# EAGLE design Netzteil_V_1.0 (EAGLE 9.4.0)
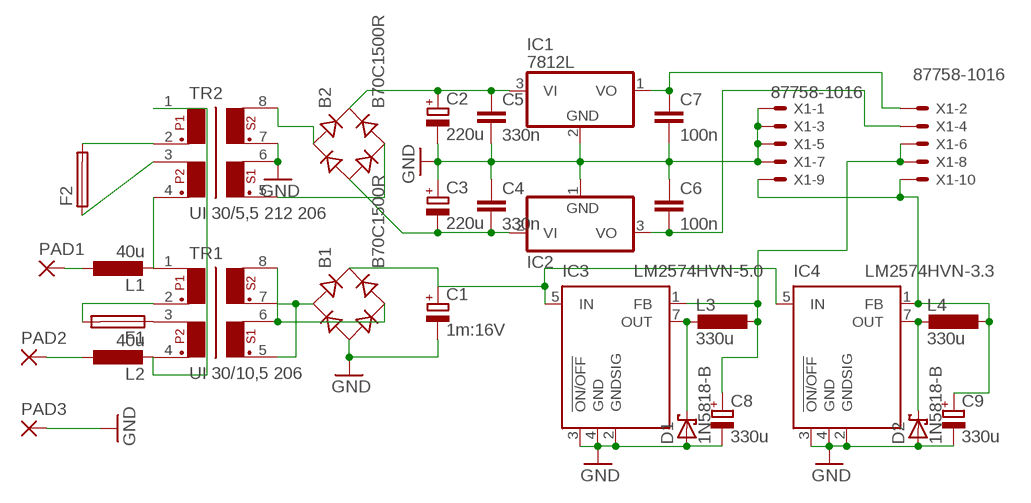
[diagram p0: schematic, sheet 1]

## Parts
B1  B70C1500R  RB1A  [RB1A]
B2  B70C1500R  RB1A  [RB1A]
C1  1m:16V  CPOL-EUE5-13  [E5-13]
C2  220u  CPOL-EUE5-10.5  [E5-10,5]
C3  220u  CPOL-EUE5-10.5  [E5-10,5]
C4  330n  C-EU102-064X133  [C102-064X133]
C5  330n  C-EU102-064X133  [C102-064X133]
C6  100n  C-EU102-064X133  [C102-064X133]
C7  100n  C-EU102-054X133  [C102-054X133]
C8  330u  CPOL-EUE2.5-7  [E2,5-7]
C9  330u  CPOL-EUE2.5-7  [E2,5-7]
D1  1N5818-B  [DO41-7.6]
D2  1N5818-B  [DO41-7.6]
F1  SH25  [SH25]
F2  SH25  [SH25]
IC1  7812L  [TO92]
IC2  7912L  [TO92]
IC3  LM2574HVN-5.0  [DIL08]
IC4  LM2574HVN-3.3  [DIL08]
L1  40u  L-EUIRF-24  [IRF24]
L2  40u  L-EUIRF-24  [IRF24]
L3  330u  L-EU0207/5V  [0207/5V]
L4  330u  L-EU0207/5V  [0207/5V]
PAD1  3,81/1,4  [3,81/1,4]
PAD2  3,81/1,4  [3,81/1,4]
PAD3  3,81/1,4  [3,81/1,4]
TR1  UI 30/10,5 206  FL02  [FL02-08]
TR2  UI 30/5,5 212 206  FL02  [FL02-08]
X1  87758-1016  [87758-1016]

## Nets
3V3: C9.+ IC4.1(FB) L4.1 X1.9 X1.10
5V: C8.+ IC3.1(FB) L3.1 X1.6 X1.8
+12V: C7.1 IC1.1(VO) X1.2
-12V: C6.2 IC2.3(VO) X1.4
GND: B1.- C1.- C2.- C3.+ C4.1 C5.2 C6.1 C7.2 C8.- C9.- D1.A D2.A IC1.2(GND) IC2.1(GND) IC3.2(GNDSIG) IC3.3(!ON/OFF) IC3.4(GND) IC4.2(GNDSIG) IC4.3(!ON/OFF) IC4.4(GND) PAD3.1(P) TR2.6 TR2.7 X1.1 X1.3 X1.5 X1.7
N$1: F1.1 TR1.3
N$2: F1.2 TR1.2
N$3: B1.AC1 TR1.5 TR1.7
N$4: B1.AC2 TR1.6 TR1.8
N$5: B1.+ C1.+ IC3.5(IN) IC4.5(IN)
N$6: B2.- C3.- C4.2 IC2.2(VI)
N$7: L1.2 TR1.1 TR2.4
N$8: L2.2 TR1.4 TR2.1
N$9: D1.C IC3.7(OUT) L3.2
N$10: B2.AC1 TR2.8
N$11: B2.AC2 TR2.5
N$12: B2.+ C2.+ C5.1 IC1.3(VI)
N$13: F2.1 TR2.3
N$14: F2.2 TR2.2
N$16: D2.C IC4.7(OUT) L4.2
N$18: L1.1 PAD1.1(P)
N$20: L2.1 PAD2.1(P)

## Library data of the parts
B1 B2 = rectifier:RB1A: RECTIFIER 1 A
C1-C3 C8 C9 = rcl:CPOL-EU: POLARIZED CAPACITOR, European symbol; SPICEPREFIX: C
C4-C7 = rcl:C-EU: CAPACITOR, European symbol; SPICEPREFIX: C
D1 D2 = diode:1N581*: 1.0A SCHOTTKY BARRIER RECTIFIER Source: http://www.diodes.com/datasheets/ds23001.pdf
F1 F2 = fuse:SH25: FUSE HOLDER grid 25 mm, OGN0031 8211, Schurter (Buerklin); MF: SCHURTER; MPN: 0031.8211; OC_FARNELL: 1162741; OC_NEWARK: 96B9380
IC1 = linear:78*: Positive VOLTAGE REGULATOR Source: http://cache.national.com/ds/LM/LM78L05.pdf http://www.fairchildsemi.com/ds/LM/LM7805.pdf
IC2 = linear:79*: Negative VOLTAGE REGULATOR
IC3 IC4 = linear:LM2574?-*: SIMPLE SWITCHER 0.5A Step-Down Voltage Regulator Source: http://cache.national.com/ds/LM/LM2574.pdf
L1-L4 = rcl:L-EU: INDUCTOR, European symbol; SPICEPREFIX: L
PAD1-PAD3 = wirepad:3,81/1,4: THROUGH-HOLE PAD
TR1 TR2 = trafo:FL02: TRANSFORMER 2 primary winding, 2 secondary windings, mounting holes BLOCK
X1 = con-molex:87758-1016: 10 Pin - 2mm Dual Row Single Wafer, Vertical T/H HDR Source: http://www.molex.com/pdm_docs/sd/877580616_sd.pdf; MF: MOLEX; MPN: 87758-1016; OC_FARNELL: 7472340; OC_NEWARK: 59J1558

## Board
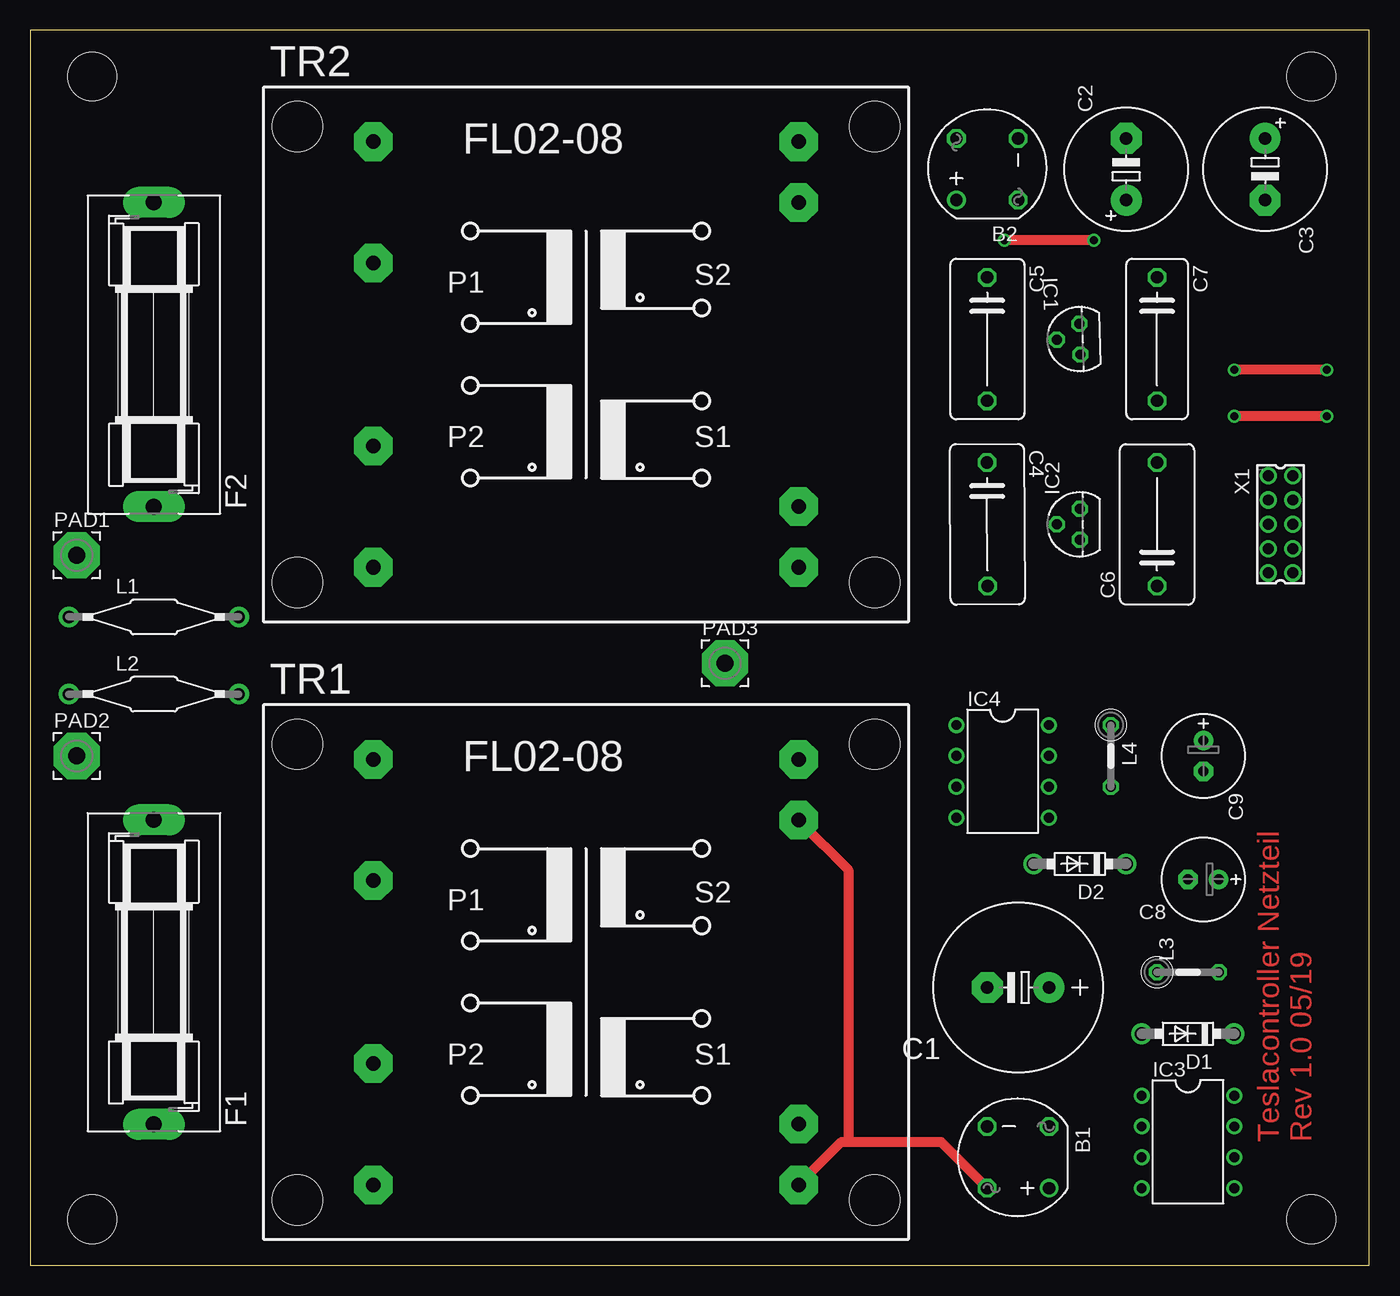
[diagram p1: board, top side]
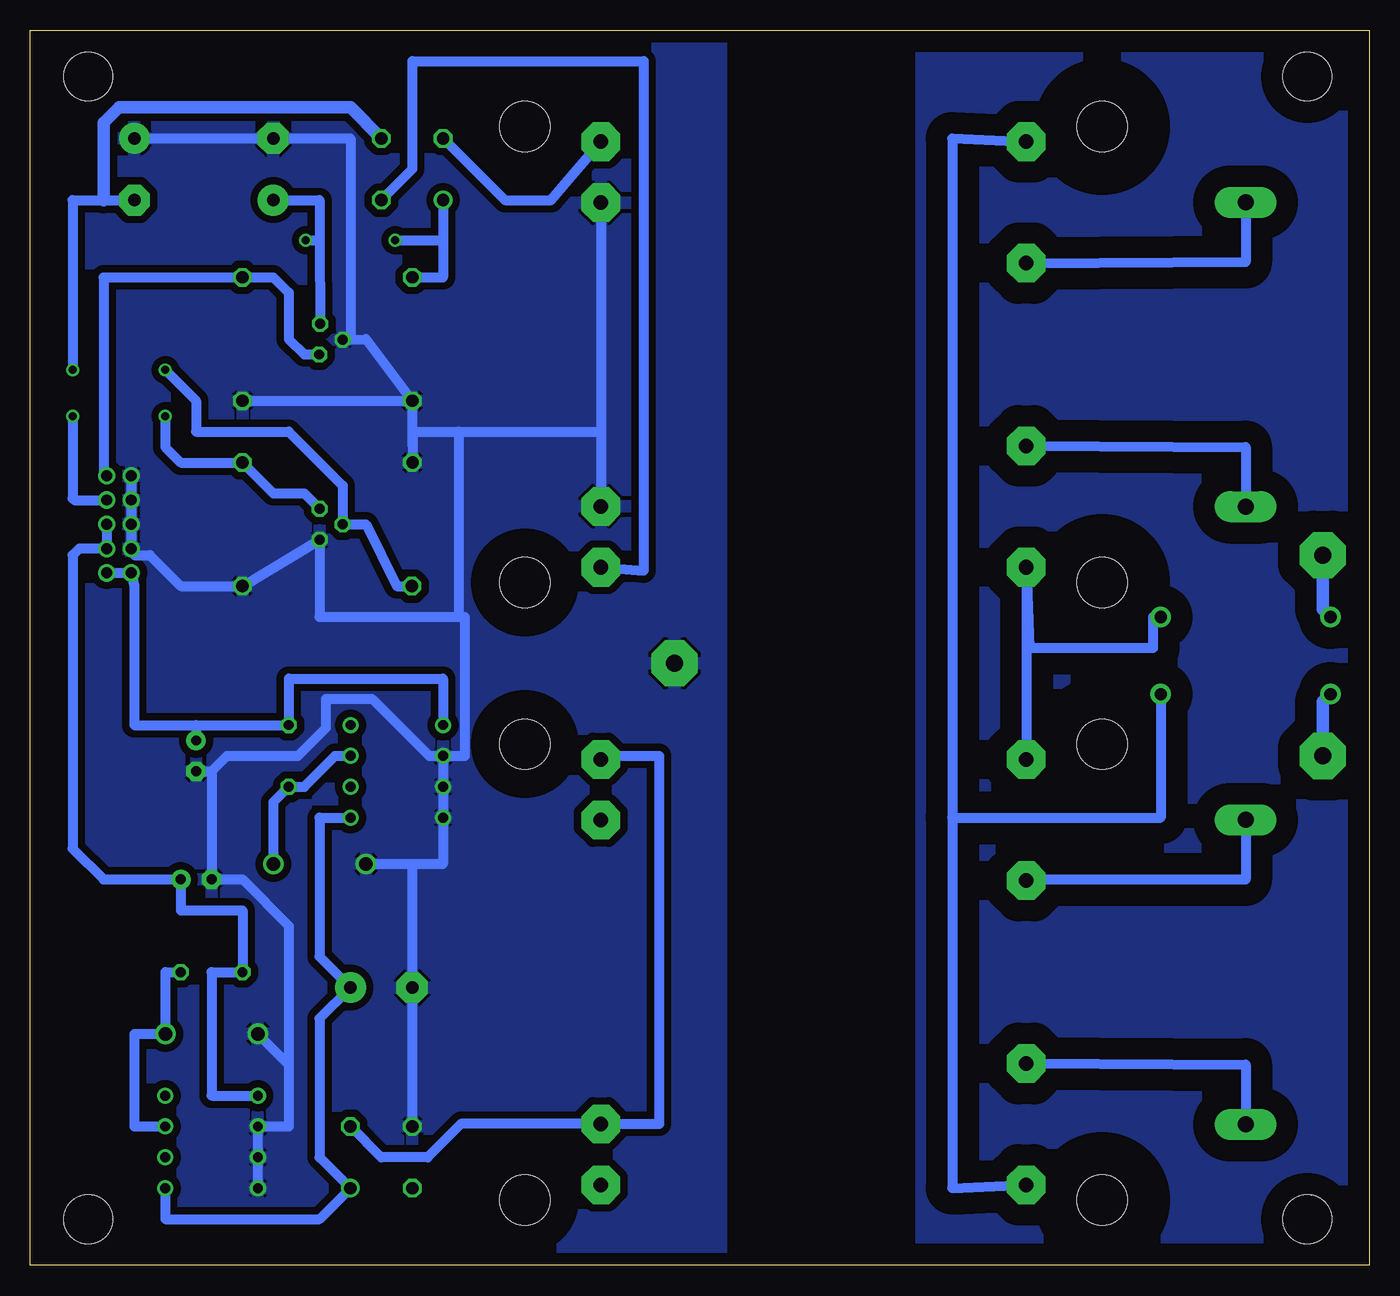
[diagram p2: board, bottom side, seen from below]

Size 110.16 x 101.59 mm. Coordinates in mm from the lower left corner, seen from the top.
Outline: 0,0 110.16,0 110.16,101.59 0,101.59 0,0
Copper layers (1*16): Top 0.035mm / dielectric 1.5mm / Bottom 0.035mm
Design rules "default": minimum track width 6mil, minimum drill 0.35mm, track to track 6mil, track to pad 6mil, pad to pad 6mil, via to via 6mil, smd to smd 6mil, copper to edge 40mil, drill to drill 6mil, minimum pad ring 10mil, minimum via ring 8mil, stop-mask expansion 4mil, vias tented up to drill 0mil, thermal gap 10mil
Holes 4 mm at 5.08,97.79 105.41,97.79 5.08,3.81 105.41,3.81

### Footprints (pad centres in the part's own frame; a part is rotated, then mirrored left to right if it is on the bottom)
RB1A = drill 1.016: + -2.54,2.54 | drill 1.016 octagon: - 2.54,-2.54; AC1 2.54,2.54; AC2 -2.54,-2.54
E5-13 = drill 1.016 pad 2.54: + -2.54,0 | drill 1.016 pad 2.54 octagon: - 2.54,0
E5-10,5 = drill 1.016 pad 2.54: + -2.54,0 | drill 1.016 pad 2.54 octagon: - 2.54,0
C102-064X133 = drill 1.016 octagon: 1 -5.08,0; 2 5.08,0
C102-054X133 = drill 1.016 octagon: 1 -5.08,0; 2 5.08,0
E2,5-7 = drill 0.813 pad 1.6: + -1.27,0 | drill 0.813 pad 1.6 octagon: - 1.27,0
DO41-7.6 = drill 1.1 pad 1.7: A 3.81,0; C -3.81,0
SH25 = drill 1.321 pad 2.54 long: 1 -12.522,0; 2 12.522,0
TO92 = drill 0.813 octagon: 1 -1.27,0; 2 0,1.905; 3 1.27,0
DIL08 = drill 0.813 pad 1.27: 1 -3.81,-3.81; 2 -1.27,-3.81; 3 1.27,-3.81; 4 3.81,-3.81; 5 3.81,3.81; 6 1.27,3.81; 7 -1.27,3.81; 8 -3.81,3.81
IRF24 = drill 1 pad 1.676: 1 -6.985,0; 2 6.985,0
0207/5V = drill 0.813 octagon: 1 -2.54,0; 2 2.54,0
3,81/1,4 = drill 1.397 pad 3.81 octagon: 1 0,0
FL02-08 = drill 1.194 pad 3.175 octagon: 1 -17.501,17.501; 2 -17.501,7.518; 3 -17.501,-7.518; 4 -17.501,-17.501; 5 17.501,-17.501; 6 17.501,-12.497; 7 17.501,12.497; 8 17.501,17.501 | hole 4.115: 23.749,18.745; 23.749,-18.745; -23.749,-18.745; -23.749,18.745
87758-1016 = drill 0.9 pad 1.27: 1 -4,-1; 2 -4,1; 3 -2,-1; 4 -2,1; 5 0,-1; 6 0,1; 7 2,-1; 8 2,1; 9 4,-1; 10 4,1

### Placement (x,y rotation side)
B1  81.28,8.89 180 top
B2  78.74,90.17 90 top
C1  81.28,22.86 180 top
C2  90.17,90.17 90 top
C3  101.6,90.17 270 top
C4  78.74,60.96 270.3 top
C5  78.74,76.2 270 top
C6  92.71,60.96 90 top
C7  92.71,76.2 270 top
C8  96.52,31.75 180 top
C9  96.52,41.91 270 top
D1  95.25,19.05 180 top
D2  86.36,33.02 180 top
F1  10.16,24.13 90 top
F2  10.16,74.93 90 top
IC1  86.36,76.2 91.8 top
IC2  86.36,60.96 90 top
IC3  95.25,10.16 270 top
IC4  80.01,40.64 270 top
L1  10.16,53.34 0 top
L2  10.16,46.99 0 top
L3  95.25,24.13 0 top
L4  88.9,41.91 270 top
PAD1  3.81,58.42 0 top
PAD2  3.81,41.91 0 top
PAD3  57.15,49.53 0 top
TR1  45.72,24.13 0 top
TR2  45.72,74.93 0 top
X1  102.87,60.96 270 top

### Tracks (layer width: path | path; a pad name or v marks a point on that pad's centre or on a via)
3V3
  Bottom 0.813: IC4.1 76.2,48.26 88.9,48.26 L4.1 96.52,44.45 | 96.52,44.45 C9.+ | X1.10 X1.9 101.6,55.88 101.6,44.45 96.52,44.45
5V
  Bottom 0.813: IC3.1 95.25,13.97 95.25,24.13 L3.1 92.71,29.21 97.79,29.21 C8.+ 104.14,31.75 106.68,34.29 106.68,58.42 106.14,58.96 X1.8 X1.6
+12V
  Bottom 0.813: IC1.1 87.63,74.93 88.9,76.2 88.9,80.01 90.17,81.28 C7.1 104.14,81.28 104.14,64.77 X1.2
-12V  (via drill 0.65)
  Top 0.813: v106.68,69.85 v99.06,69.85
  Bottom 0.813: IC2.3 87.63,63.5 90.17,63.5 C6.2 97.79,66.04 99.06,67.31 v99.06,69.85 | X1.4 106.54,62.96 106.68,63.1 v106.68,69.85
EA
  pour Bottom (isolate 1.778): 0,101.6 36.83,101.6 36.83,0 0,0
GND
  Bottom 0.813: TR2.7 63.22,68.58 | 63.22,68.58 TR2.6 | C5.2 C4.1 78.74,68.58 | 78.74,68.58 74.93,68.58 | 74.93,68.58 63.22,68.58 | C3.+ C2.- 83.82,92.71 83.82,76.16 | 83.82,76.16 82.55,76.2 | 83.82,76.16 IC1.2 82.55,76.2 | B1.- C1.- 78.74,33.02 D2.A 76.2,33.02 IC4.4 IC4.3 IC4.2 | IC3.4 IC3.3 IC3.2 88.9,11.43 88.9,16.51 | D1.A 88.9,16.51 | 82.55,76.2 C5.2 | C5.2 78.74,68.58 | IC4.2 74.42,41.91 74.42,53.34 74.93,53.34 | 74.93,68.58 74.93,53.34 | 74.93,53.34 86.36,53.34 IC2.1 C6.1 97.79,55.88 100.33,58.42 101.6,58.42 X1.7 X1.5 X1.3 X1.1 | C9.- 95.25,40.64 | 95.25,40.64 C8.- 92.71,31.75 88.9,27.94 88.9,16.51 | 95.25,40.64 93.98,41.91 88.14,41.91 85.85,44.2 85.85,46.61 82.04,46.61 77.34,41.91 IC4.2 | C7.2 C5.2
  pour Bottom (isolate 0.61): 53.34,101.6 110.49,101.6 110.49,0 53.34,0
N$1
  Bottom 0.813: F1.1 10.16,16.51 TR1.3
N$2
  Bottom 0.813: F1.2 10.16,31.75 29.21,31.75 TR1.2
N$3
  Top 0.813: TR1.5 66.75,10.16 67.31,10.16 | 67.31,10.16 74.93,10.16 B1.AC1 | TR1.7 67.31,32.54 67.31,10.16
  Bottom 0.813: 63.5,6.35 TR1.5
N$4
  Bottom 0.813: TR1.8 63.5,41.91 58.42,41.91 58.42,11.63 TR1.6 | 63.5,11.43 TR1.6 | B1.AC2 81.28,8.89 77.47,8.89 74.73,11.63 TR1.6
N$5
  Bottom 0.813: IC4.5 86.36,36.83 86.36,25.4 C1.+ 86.36,20.32 86.36,8.89 B1.+ 86.36,3.81 99.06,3.81 IC3.5
N$6  (via drill 0.65)
  Top 0.813: v106.68,73.66 v99.06,73.66
  Bottom 0.813: C4.2 80.01,55.88 82.55,60.96 IC2.2 84.45,64.14 88.9,68.58 96.52,68.58 96.52,71.12 v99.06,73.66 | v106.68,73.66 106.68,87.63 104.14,87.63 C3.-
  Bottom 1.016: 104.14,87.63 104.14,93.98 102.87,95.25 83.82,95.25 B2.-
N$7
  Bottom 0.813: TR1.1 TR2.4 27.94,50.8 17.78,50.8 17.78,53.34 L1.2
N$8
  Bottom 0.813: TR2.1 34.29,92.71 34.29,36.83 | 34.29,36.83 34.29,6.35 TR1.4 | L2.2 17.14,36.83 34.29,36.83
N$9
  Bottom 0.813: L3.2 99.06,24.13 D1.C 101.6,19.05 101.6,11.43 IC3.7
N$10
  Bottom 0.813: TR2.8 67.31,87.63 71.12,87.63 B2.AC1
N$11
  Bottom 0.813: TR2.5 59.69,57.15 59.69,99.06 78.74,99.06 78.74,90.17 B2.AC2
N$12  (via drill 0.65)
  Top 0.813: v87.5,84.33 v80.14,84.33
  Bottom 0.813: B2.+ 76.2,84.33 | 76.2,84.33 76.2,81.28 C5.1 | C2.+ 86.36,87.63 86.35,84.33 | 86.35,84.33 IC1.3 | v87.5,84.33 86.35,84.33 | 86.35,84.33 | v80.14,84.33 76.2,84.33
N$13
  Bottom 0.813: TR2.3 10.16,67.31 F2.1
N$14
  Bottom 0.813: F2.2 10.16,82.55 TR2.2
N$16
  Bottom 0.813: D2.C 90.17,38.1 L4.2 87.63,39.37 85.09,41.91 IC4.7
N$18
  Bottom 1.016: L1.1 3.81,53.98 PAD1.1
N$20
  Bottom 1.016: L2.1 3.81,46.35 PAD2.1

### Text on the board
Top: Teslacontroller Netzteil / Rev 1.0 05/19